# EAGLE design esquematico (EAGLE 9.6.2)
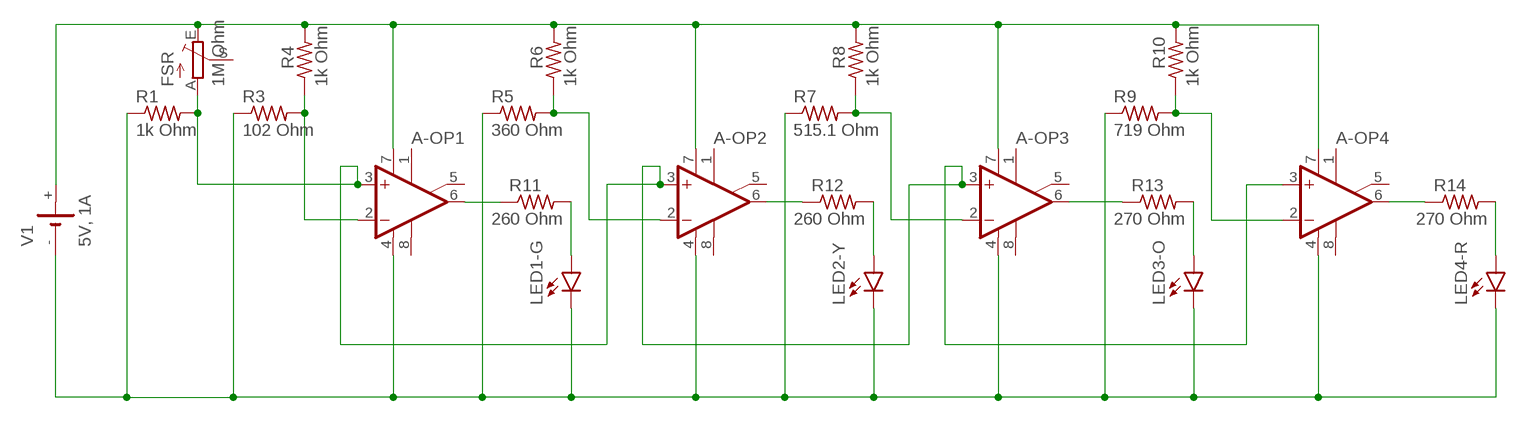
[diagram p0: schematic, sheet 1]

## Parts
A-OP1  UA741P  [DIL08]
A-OP2  UA741P  [DIL08]
A-OP3  UA741P  [DIL08]
A-OP4  UA741P  [DIL08]
FSR  1M Ohm  TRIM_EU-CIP20C-4MM  [CIP20C-4MM]
LED1-G  TLLR4400  [LED3MM]
LED2-Y  TLLR4400  [LED3MM]
LED3-O  TLLR4400  [LED3MM]
LED4-R  TLLR4400  [LED3MM]
R1  1k Ohm  R-US_0204/5  [0204/5]
R3  102 Ohm  R-US_0204/5  [0204/5]
R4  1k Ohm  R-US_0204/5  [0204/5]
R5  360 Ohm  R-US_0204/5  [0204/5]
R6  1k Ohm  R-US_0204/5  [0204/5]
R7  515.1 Ohm  R-US_0204/5  [0204/5]
R8  1k Ohm  R-US_0204/5  [0204/5]
R9  719 Ohm  R-US_0204/5  [0204/5]
R10  1k Ohm  R-US_0204/5  [0204/5]
R11  260 Ohm  R-US_0204/5  [0204/5]
R12  260 Ohm  R-US_0204/5  [0204/5]
R13  270 Ohm  R-US_0204/5  [0204/5]
R14  270 Ohm  R-US_0204/5  [0204/5]
V1  5V, 1A  CH291-1220LF  [CH291-1220LF]

## Nets
N$1: A-OP1.7(V+) A-OP2.7(V+) A-OP3.7(V+) A-OP4.7(V+) FSR.E R4.2 R6.2 R8.2 R10.2 V1.+
N$2: A-OP1.3(+IN) A-OP2.3(+IN) A-OP3.3(+IN) A-OP4.3(+IN) FSR.A R1.2
N$3: A-OP1.4(V-) A-OP2.4(V-) A-OP3.4(V-) A-OP4.4(V-) LED1-G.K(C) LED2-Y.K(C) LED3-O.K(C) LED4-R.K(C) R1.1 R3.1 R5.1 R7.1 R9.1 V1.-
N$4: A-OP1.2(-IN) R3.2 R4.1
N$5: LED1-G.A R11.2
N$6: A-OP2.2(-IN) R5.2 R6.1
N$7: A-OP1.6(OUT) R11.1
N$8: A-OP2.6(OUT) R12.1
N$9: LED2-Y.A R12.2
N$10: A-OP3.2(-IN) R7.2 R8.1
N$11: A-OP4.2(-IN) R9.2 R10.1
N$12: A-OP3.6(OUT) R13.1
N$13: LED3-O.A R13.2
N$14: A-OP4.6(OUT) R14.1
N$15: LED4-R.A R14.2
Unconnected: A-OP1.1(ON1) A-OP1.5(ON2) A-OP1.8(OPT) A-OP2.1(ON1) A-OP2.5(ON2) A-OP2.8(OPT) A-OP3.1(ON1) A-OP3.5(ON2) A-OP3.8(OPT) A-OP4.1(ON1) A-OP4.5(ON2) A-OP4.8(OPT) FSR.S

## Library data of the parts
A-OP1-A-OP4 = linear:*741: OP AMP
FSR = pot:TRIM_EU-: POTENTIOMETER
LED1-G LED2-Y LED3-O LED4-R = led:TLLR4400: Low Current (2mA) LED 3 mm Tinted Diffused Package color RED Source: Data sheet <http://www.farnell.com/datasheets/391100.pdf>; MF: VISHAY SEMICONDUCTOR; OC_FARNELL: 1612437
R1 R3-R14 = rcl:R-US_: RESISTOR, American symbol; SPICEPREFIX: R
V1 = battery:CH291-1220LF: Battery Holder, SMT, 12mm multicomp PART NO. CH291-1220LF Source: Data sheet <http://www.farnell.com/datasheets/1505860.pdf>

## Board
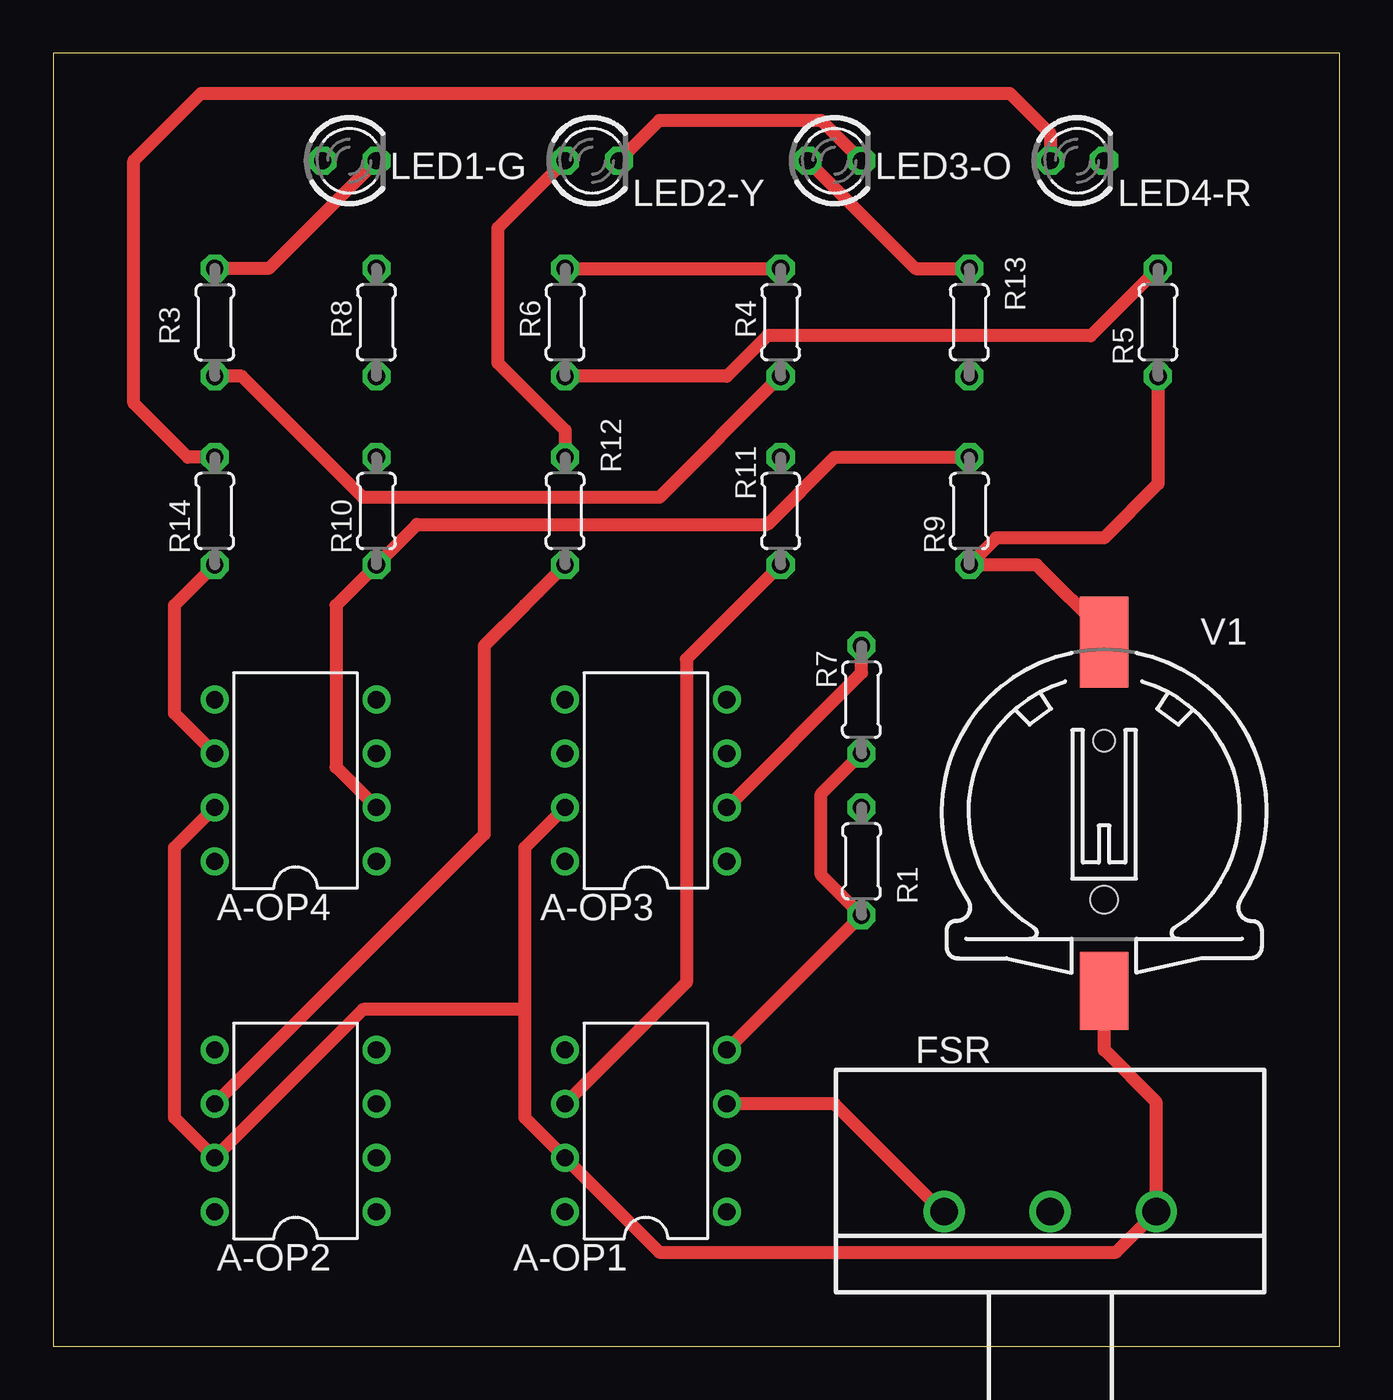
[diagram p1: board, top side]
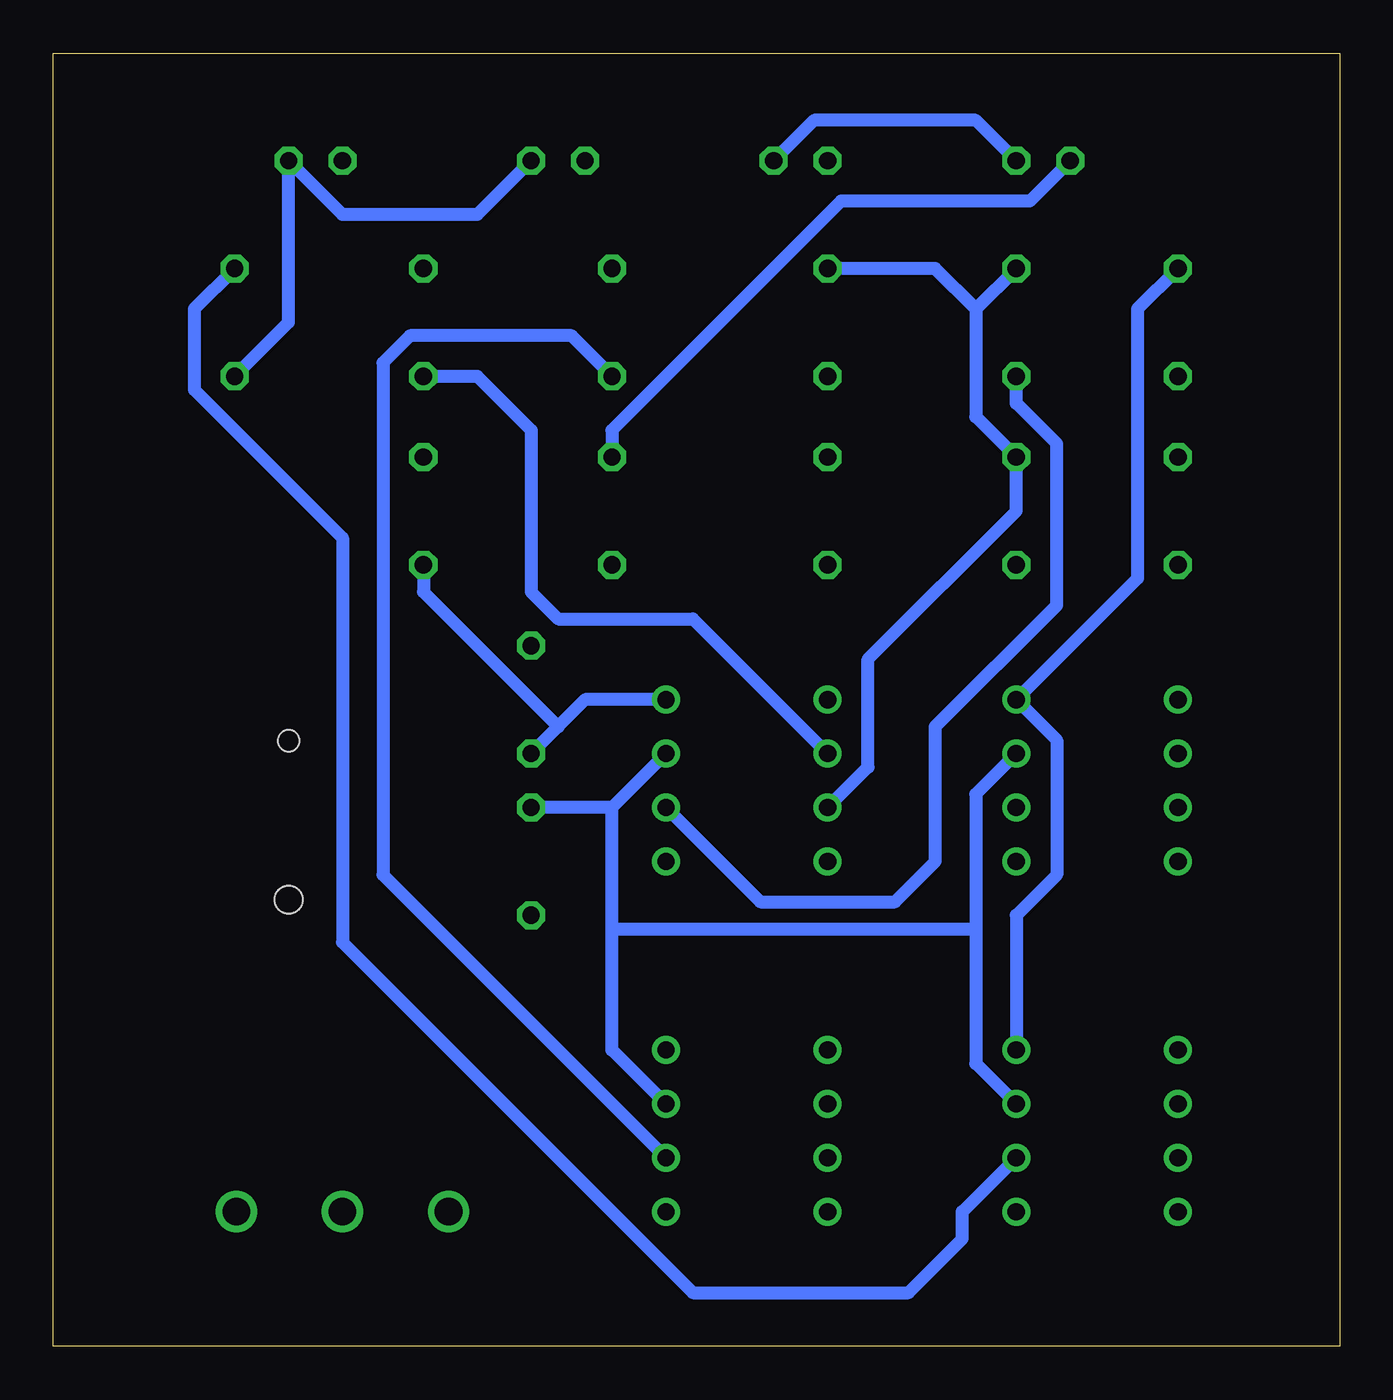
[diagram p2: board, bottom side, seen from below]

Size 60.63 x 60.95 mm. Coordinates in mm from the lower left corner, seen from the top.
Outline: 0,0 60.63,0 60.63,60.95 0,60.95 0,0
Copper layers (1*16): Top 0.035mm / dielectric 1.5mm / Bottom 0.035mm
Design rules "default *": minimum track width 24mil, minimum drill 0.35mm, track to track 26mil, track to pad 24mil, pad to pad 6mil, via to via 24mil, smd to smd 6mil, copper to edge 40mil, drill to drill 6mil, minimum pad ring 10mil, minimum via ring 8mil, stop-mask expansion 4mil, vias tented up to drill 0mil, thermal gap 10mil

### Footprints (pad centres in the part's own frame; a part is rotated, then mirrored left to right if it is on the bottom)
DIL08 = drill 0.813 pad 1.27: 1 -3.81,-3.81; 2 -1.27,-3.81; 3 1.27,-3.81; 4 3.81,-3.81; 5 3.81,3.81; 6 1.27,3.81; 7 -1.27,3.81; 8 -3.81,3.81
CIP20C-4MM = drill 1.3 pad 1.93: A -5,0; E 5,0; S 0,0
LED3MM = drill 0.813 octagon: A -1.27,0; K 1.27,0
0204/5 = drill 0.813 octagon: 1 -2.54,0; 2 2.54,0
CH291-1220LF = smd 2.3 x 3.66: + 0,-2.296 | smd 2.3 x 4.3: - 0,14.146 | hole 1.3: 0,2 | hole 1: 0,9.5

### Placement (x,y rotation side)
A-OP1  27.94,10.16 90 top
A-OP2  11.43,10.16 90 top
A-OP3  27.94,26.67 90 top
A-OP4  11.43,26.67 90 top
FSR  46.99,6.35 0 top
LED1-G  13.97,55.88 0 top
LED2-Y  25.4,55.88 0 top
LED3-O  36.83,55.88 0 top
LED4-R  48.26,55.88 0 top
R1  38.1,22.86 90 top
R3  7.62,48.26 270 top
R4  34.29,48.26 90 top
R5  52.07,48.26 90 top
R6  24.13,48.26 90 top
R7  38.1,30.48 90 top
R8  15.24,48.26 90 top
R9  43.18,39.37 90 top
R10  15.24,39.37 90 top
R11  34.29,39.37 90 top
R12  24.13,39.37 90 top
R13  43.18,48.26 90 top
R14  7.62,39.37 90 top
V1  49.53,19.05 0 top

### Tracks (layer width: path | path; a pad name or v marks a point on that pad's centre or on a via)
N$1
  Top 0.61: R6.2 R4.2 | A-OP4.7 5.71,23.5 5.71,10.79 A-OP2.7 14.61,15.88 22.23,15.88 | 22.23,15.88 22.23,23.5 A-OP3.7 | 22.23,15.88 22.23,10.79 A-OP1.7 28.57,4.45 50.09,4.45 FSR.E 51.99,11.51 49.53,13.97 V1.+
  Bottom 0.61: 17.14,48.9 17.14,43.81 R10.2 15.24,39.37 22.23,32.38 22.23,27.3 A-OP3.7 | R8.2 17.14,48.9 | R6.2 19.05,50.8 17.14,48.9
N$2
  Top 0.61: A-OP1.3 36.83,11.43 41.91,6.35 FSR.A
  Bottom 0.61: A-OP2.3 17.14,13.34 17.14,19.68 | 17.14,19.68 17.14,26.04 A-OP4.3 | 34.29,25.4 R1.2 | A-OP3.3 34.29,25.4 | 34.29,19.68 34.29,13.97 A-OP1.3 | 34.29,19.68 34.29,25.4 | 34.29,19.68 17.14,19.68
N$3
  Top 0.61: A-OP1.4 R1.1 36.2,22.23 36.2,26.04 R7.1 | V1.- 49.53,33.66 46.35,36.83 R9.1 44.45,38.1 49.53,38.1 52.07,40.64 R5.1 | R3.1 10.16,50.8 LED1-G.K | LED3-O.K 36.2,57.78 28.57,57.78 LED2-Y.K
  Bottom 0.61: 36.83,29.21 35.56,30.48 A-OP3.4 | 36.83,29.21 R7.1 | R5.1 49.53,48.26 LED4-R.K 46.99,53.34 40.64,53.34 LED3-O.K | 36.83,29.21 43.18,35.56 R9.1 | A-OP2.4 15.24,20.32 13.34,22.23 13.34,28.57 A-OP4.4 9.53,36.2 9.53,48.9 R3.1 | LED2-Y.K 24.77,57.78 17.14,57.78 LED1-G.K
N$4
  Top 0.61: R3.2 8.89,45.72 14.61,40.01 28.57,40.01 R4.1
  Bottom 0.61: A-OP1.2 45.09,22.23 45.09,46.35 43.81,47.62 36.2,47.62 R4.1
N$5
  Bottom 0.61: R11.2 34.29,43.18 23.5,53.98 14.61,53.98 LED1-G.A
N$6
  Top 0.61: R6.1 31.75,45.72 33.66,47.62 48.9,47.62 R5.2
  Bottom 0.61: R5.2 53.98,48.9 53.98,45.09 46.99,38.1 46.99,19.05 30.48,2.54 20.32,2.54 17.78,5.08 17.78,6.35 A-OP2.2
N$7
  Top 0.61: A-OP1.6 29.84,17.14 29.84,32.38 R11.1
N$8
  Top 0.61: R12.1 22.86,35.56 22.23,34.92 20.32,33.02 20.32,24.13 A-OP2.6
N$9
  Top 0.61: R12.2 24.13,43.18 20.95,46.35 20.95,52.7 LED2-Y.A
N$10
  Top 0.61: R7.2 38.1,31.75 A-OP3.2
  Bottom 0.61: R8.1 15.24,44.45 13.34,42.55 13.34,34.92 19.05,29.21 19.05,22.86 20.95,20.95 27.3,20.95 A-OP3.2
N$11
  Top 0.61: A-OP4.2 13.34,27.3 13.34,34.92 R10.1 17.14,38.73 33.66,38.73 36.83,41.91 R9.2
N$12
  Bottom 0.61: R13.1 40.64,45.72 38.1,43.18 38.1,35.56 36.83,34.29 30.48,34.29 A-OP3.6
N$13
  Top 0.61: R13.2 40.64,50.8 LED3-O.A
N$14
  Top 0.61: A-OP4.6 5.71,29.84 5.71,34.92 R14.1
N$15
  Top 0.61: R14.2 6.35,41.91 3.81,44.45 3.81,55.88 6.99,59.05 45.09,59.05 46.99,57.15 LED4-R.A